# EAGLE design ESP32_zigbee_zwaveV1 (EAGLE 9.6.2)
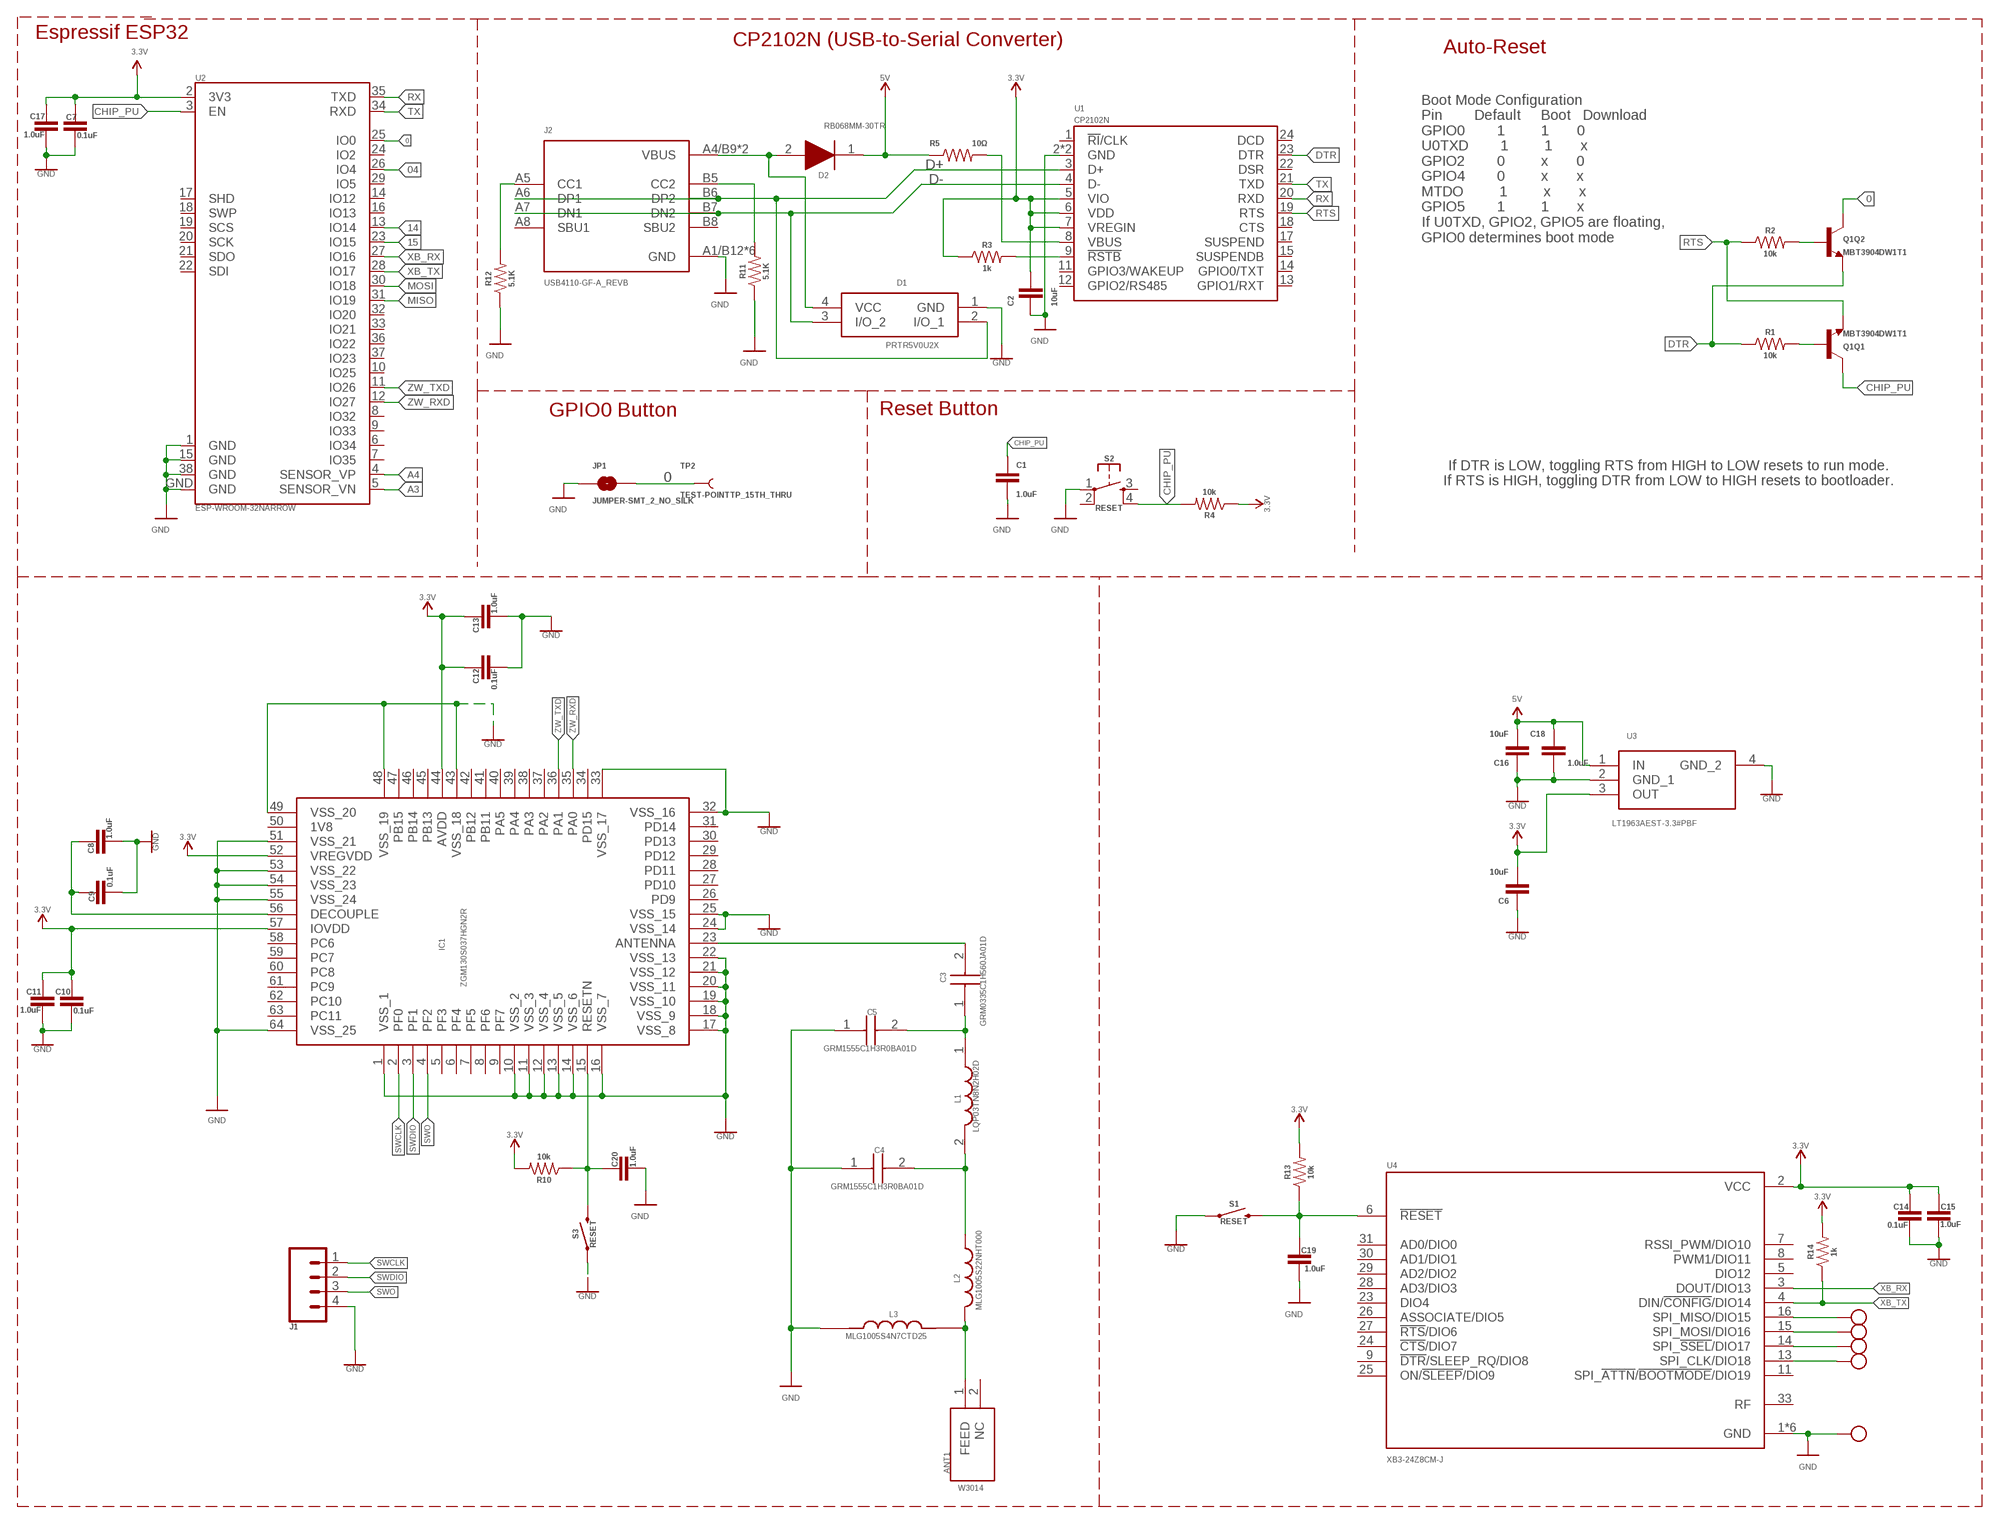
[diagram p0: schematic, sheet 1]

## Parts
ANT1  W3014  [ANTC10032X155N]
C1  1.0uF  1.0UF-0402T-16V-10%  [0402-TIGHT]
C2  10uF  10UF-0402T-6.3V-20%  [0402-TIGHT]
C3  GRM0335C1H560JA01D  [CAPC0603X33N]
C4  GRM1555C1H3R0BA01D  [CAPC1005X55N]
C5  GRM1555C1H3R0BA01D  [CAPC1005X55N]
C6  10uF  10UF-0805-25V-10%  [0805]
C7  0.1uF  0.1UF-0402T-6.3V-10%-X7R  [0402-TIGHT]
C8  1.0uF  1.0UF-0402T-16V-10%  [0402-TIGHT]
C9  0.1uF  0.1UF-0402T-6.3V-10%-X7R  [0402-TIGHT]
C10  0.1uF  0.1UF-0402T-6.3V-10%-X7R  [0402-TIGHT]
C11  1.0uF  1.0UF-0402T-16V-10%  [0402-TIGHT]
C12  0.1uF  0.1UF-0402T-6.3V-10%-X7R  [0402-TIGHT]
C13  1.0uF  1.0UF-0402T-16V-10%  [0402-TIGHT]
C14  0.1uF  0.1UF-0402T-6.3V-10%-X7R  [0402-TIGHT]
C15  1.0uF  1.0UF-0402T-16V-10%  [0402-TIGHT]
C16  10uF  10UF-0805-25V-10%  [0805]
C17  1.0uF  1.0UF-0402T-16V-10%  [0402-TIGHT]
C18  1.0uF  1.0UF-0402T-16V-10%  [0402-TIGHT]
C19  1.0uF  1.0UF-0402T-16V-10%  [0402-TIGHT]
C20  1.0uF  1.0UF-0402T-16V-10%  [0402-TIGHT]
D1  PRTR5V0U2X  [PRTR5V0U2X]
D2  RB068MM-30TR  [SODFL3516X90N]
IC1  ZGM130S037HGN2R  [ZGM130S037HGN2R]
J1  CONN_041X04_NO_SILK  [1X04_NO_SILK]
J2  USB4110-GF-A_REVB  [GCT_USB4110-GF-A_REVB]
JP1  JUMPER-SMT_2_NO_SILK  [SMT-JUMPER_2_NO_SILK]
L1  LQP03TN8N2H02D  [LQP03TG3N1B02D]
L2  MLG1005S22NHT000  [INDC1005X55N]
L3  MLG1005S4N7CTD25  [INDC1005X55N]
Q1  MBT3904DW1T1  TRANS_NPN_DUAL-MBT3904DW1T1  [SC70-6]
R1  10k  10KOHM-0402T-1/16W-1%  [0402-TIGHT]
R2  10k  10KOHM-0402T-1/16W-1%  [0402-TIGHT]
R3  1k  1KOHM-0402T-1/16W-1%  [0402-TIGHT]
R4  10k  10KOHM-0402T-1/16W-1%  [0402-TIGHT]
R5  10Ω  10OHM-0402-1/16W-5%  [0402-TIGHT]
R10  10k  10KOHM-0402-1/10W-0.1%  [0402-TIGHT]
R11  5.1K  RESISTOR0402T  [0402-TIGHT]
R12  5.1K  RESISTOR0402T  [0402-TIGHT]
R13  10k  10KOHM-0402-1/10W-0.1%  [0402-TIGHT]
R14  1k  1KOHM-0402T-1/16W-1%  [0402-TIGHT]
S1  RESET  MOMENTARY-SWITCH-SPST-SMD-4.6X2.8MM  [TACTILE_SWITCH_SMD_4.6X2.8MM]
S2  RESET  MOMENTARY-SWITCH-SPST-2-SMD-4.6X2.8MM  [TACTILE_SWITCH_SMD_4.6X2.8MM]
S3  RESET  MOMENTARY-SWITCH-SPST-SMD-4.6X2.8MM  [TACTILE_SWITCH_SMD_4.6X2.8MM]
TP1  TESTPOINT1.5X2.0MM_NOCREAM  [PAD-1.5X2.0]
TP2  TEST-POINTTP_15TH_THRU  [TP_15TH]
TP3  TESTPOINT1.5X2.0MM_NOCREAM  [PAD-1.5X2.0]
TP4  TESTPOINT1.5X2.0MM_NOCREAM  [PAD-1.5X2.0]
TP5  TESTPOINT1.5X2.0MM_NOCREAM  [PAD-1.5X2.0]
TP6  TESTPOINT1.5X2.0MM_NOCREAM  [PAD-1.5X2.0]
U1  CP2102N  [QFN24]
U2  ESP-WROOM-32NARROW  [ESP-WROOM-32-NARROW]
U3  LT1963AEST-3.3#PBF  [SOT230P700X180-4N]
U4  XB3-24Z8CM-J  [XCVR_XB3-24Z8CM-J]

## Nets
0: JP1.2 Q1.6(Q2:C) TP2.P$1 U2.25(IO0)
3.3V: C2.1 C6.2 C7.1 C10.1 C11.2 C12.1 C13.2 C14.1 C15.2 C17.2 IC1.44(AVDD) IC1.52(VREGVDD) IC1.57(IOVDD) R3.1 R4.1 R10.2 R13.2 R14.2 U1.5(VIO) U1.6(VDD) U1.7(VREGIN) U2.2(3V3) U3.3(OUT) U4.2(VCC)
04: U2.26(IO4)
5V: C16.2 C18.2 D2.1(K) R5.1 U3.1(IN)
14: U2.13(IO14)
15: U2.23(IO15)
A3: U2.5(SENSOR_VN)
A4: U2.4(SENSOR_VP)
CHIP_PU: C1.1 Q1.3(Q1:C) R4.2 S2.4 U2.3(EN)
D+: D1.2(I/O_1) J2.A6(DP1) J2.B6(DP2) U1.3(D+)
D-: D1.3(I/O_2) J2.A7(DN1) J2.B7(DN2) U1.4(D-)
DTR: Q1.1(Q2:E) R1.1 U1.23(DTR)
GND: C1.2 C2.2 C4.1 C5.1 C6.1 C7.2 C8.1 C9.2 C10.2 C11.1 C12.2 C13.1 C14.2 C15.1 C16.1 C17.1 C18.1 C19.2 C20.2 D1.1(GND) IC1.1(VSS_1) IC1.10(VSS_2) IC1.11(VSS_3) IC1.12(VSS_4) IC1.13(VSS_5) IC1.14(VSS_6) IC1.16(VSS_7) IC1.17(VSS_8) IC1.18(VSS_9) IC1.19(VSS_10) IC1.20(VSS_11) IC1.21(VSS_12) IC1.22(VSS_13) IC1.24(VSS_14) IC1.25(VSS_15) IC1.32(VSS_16) IC1.33(VSS_17) IC1.43(VSS_18) IC1.48(VSS_19) IC1.49(VSS_20) IC1.51(VSS_21) IC1.53(VSS_22) IC1.54(VSS_23) IC1.55(VSS_24) IC1.64(VSS_25) J1.4 J2.A1/B12(GND) J2.B1/A12(GND) J2.S1(GND) J2.S2(GND) J2.S3(GND) J2.S4(GND) JP1.1 L3.1 R11.1 R12.1 S1.1 S1.2 S2.1 S3.1 S3.2 TP6.P$1 U1.2(GND) U1.PAD(GND) U2.1(GND) U2.15(GND) U2.38(GND) U2.GND U3.2(GND_1) U3.4(GND_2) U4.1(GND) U4.10(GND) U4.12(GND) U4.21(GND) U4.32(GND) U4.34(GND)
MISO: U2.31(IO19)
MOSI: U2.30(IO18)
N$1: Q1.5(Q1:B) R1.2
N$2: Q1.2(Q2:B) R2.2
N$3: R3.2 U1.9(!RSTB)
N$4: R5.2 U1.8(VBUS)
N$5: C3.2 IC1.23(ANTENNA)
N$6: C3.1 C5.2 L1.1
N$7: C4.2 L1.2 L2.1
N$8: ANT1.1(FEED) L2.2 L3.2
N$9: D1.4(VCC) D2.2(A) J2.A4/B9(VBUS) J2.B4/A9(VBUS)
N$10: C20.1 IC1.15(RESETN) R10.1 S3.3 S3.4
N$11: J2.B5(CC2) R11.2
N$12: J2.A5(CC1) R12.2
N$13: C19.1 R13.1 S1.3 S1.4 U4.6(!RESET)
N$14: C8.2 C9.1 IC1.56(DECOUPLE)
N$15: TP5.P$1 U4.16(SPI_MISO/DIO15)
N$16: TP1.P$1 U4.15(SPI_MOSI/DIO16)
N$17: TP3.P$1 U4.14(SPI_!SSEL!/DIO17)
N$18: TP4.P$1 U4.13(SPI_CLK/DIO18)
RTS: Q1.4(Q1:E) R2.1 U1.19(RTS)
RX: U1.20(RXD) U2.35(TXD)
SWCLK: IC1.2(PF0) J1.1
SWDIO: IC1.3(PF1) J1.2
SWO: IC1.4(PF2) J1.3
TX: U1.21(TXD) U2.34(RXD)
XB_RX: U2.27(IO16) U4.3(DOUT/DIO13)
XB_TX: R14.1 U2.28(IO17) U4.4(DIN/!CONFIG!/DIO14)
ZW_RXD: IC1.35(PA0) U2.12(IO27)
ZW_TXD: IC1.36(PA1) U2.11(IO26)
Unconnected: ANT1.2(NC) IC1.5(PF3) IC1.6(PF4) IC1.7(PF5) IC1.8(PF6) IC1.9(PF7) IC1.26(PD9) IC1.27(PD10) IC1.28(PD11) IC1.29(PD12) IC1.30(PD13) IC1.31(PD14) IC1.34(PD15) IC1.37(PA2) IC1.38(PA3) IC1.39(PA4) IC1.40(PA5) IC1.41(PB11) IC1.42(PB12) IC1.45(PB13) IC1.46(PB14) IC1.47(PB15) IC1.50(1V8) IC1.58(PC6) IC1.59(PC7) IC1.60(PC8) IC1.61(PC9) IC1.62(PC10) IC1.63(PC11) J2.A8(SBU1) J2.B8(SBU2) S2.2 S2.3 U1.1(!RI!/CLK) U1.11(GPIO3/WAKEUP) U1.12(GPIO2/RS485) U1.13(GPIO1/RXT) U1.14(GPIO0/TXT) U1.15(SUSPENDB) U1.17(SUSPEND) U1.18(CTS) U1.22(DSR) U1.24(DCD) U2.6(IO34) U2.7(IO35) U2.8(IO32) U2.9(IO33) U2.10(IO25) U2.14(IO12) U2.16(IO13) U2.17(SHD) U2.18(SWP) U2.19(SCS) U2.20(SCK) U2.21(SDO) U2.22(SDI) U2.24(IO2) U2.29(IO5) U2.32(IO20) U2.33(IO21) U2.36(IO22) U2.37(IO23) U4.5(DIO12) U4.7(RSSI_PWM/DIO10) U4.8(PWM1/DIO11) U4.9(!DTR!/SLEEP_RQ/DIO8) U4.11(SPI_!ATTN!/!BOOTMODE!/DIO19) U4.23(DIO4) U4.24(!CTS!/DIO7) U4.25(ON/!SLEEP!/DIO9) U4.26(ASSOCIATE/DIO5) U4.27(!RTS!/DIO6) U4.28(AD3/DIO3) U4.29(AD2/DIO2) U4.30(AD1/DIO1) U4.31(AD0/DIO0) U4.33(RF)

## Notes on the sheet
- Espressif ESP32
- CP2102N (USB-to-Serial Converter)
- Auto-Reset
- Boot Mode Configuration
  Pin        Default     Boot   Download
  GPIO0        1         1       0
  U0TXD        1         1       x
  GPIO2        0         x       0
  GPIO4        0         x       x
  MTDO         1         x       x
  GPIO5        1         1       x
  If U0TXD, GPIO2, GPIO5 are floating, 
  GPIO0 determines boot mode
- GPIO0 Button | Reset Button
- If DTR is LOW, toggling RTS from HIGH to LOW resets to run mode.
  If RTS is HIGH, toggling DTR from LOW to HIGH resets to bootloader.

## Library data of the parts
ANT1 = W3014:W3014: Antennas ISM Ceramic Monopole Antenna Source: Datasheet <https://www.mouser.com/datasheet/2/336/W3014-268293.pdf>; ARROW_PART_NUMBER: W3014; ARROW_PRICE-STOCK: https://www.arrow.com/en/products/w3014/pulse-electronics-corporation; DESCRIPTION: Antennas ISM Ceramic Monopole Antenna; HEIGHT: 1.55mm; MANUFACTURER_NAME: Pulse; MANUFACTURER_PART_NUMBER: W3014; MOUSER_PART_NUMBER: 673-W3014; MOUSER_PRICE-STOCK: https://www.mouser.com/Search/Refine.aspx?Keyword=673-W3014
C1 C8 C11 C13 C15 C17-C20 = ESP32_zigbee_zwaveV1:1.0UF: 1µF ceramic capacitors A capacitor is a passive two-terminal electrical component used to store electrical energy temporarily in an electric field.; PROD_ID: CAP-09822
C2 = ESP32_zigbee_zwaveV1:10UF: 10.0µF ceramic capacitors A capacitor is a passive two-terminal electrical component used to store electrical energy temporarily in an electric field.; PROD_ID: CAP-09824
C3 = ESP32_zigbee_zwaveV1:GRM0335C1H560JA01D: Murata 0201 GRM 56pF Ceramic Multilayer Capacitor, 50 V, +125C, C0G Dielectric, +/-5% SMD Source: Datasheet <https://psearch.en.murata.com/capacitor/product/GRM0335C1H560JA01#.html>; ARROW_PART_NUMBER: GRM0335C1H560JA01D; ARROW_PRICE-STOCK: https://www.arrow.com/en/products/grm0335c1h560ja01d/murata-manufacturing; DESCRIPTION: Murata 0201 GRM 56pF Ceramic Multilayer Capacitor, 50 V, +125C, C0G Dielectric, +/-5% SMD; HEIGHT: 0.33mm; MANUFACTURER_NAME: Murata Electronics; MANUFACTURER_PART_NUMBER: GRM0335C1H560JA01D; MOUSER_PART_NUMBER: 81-GRM0335C1H560JA1D; MOUSER_PRICE-STOCK: https://www.mouser.com/Search/Refine.aspx?Keyword=81-GRM0335C1H560JA1D
C4 C5 = ESP32_zigbee_zwaveV1:GRM1555C1H3R0BA01D: Capacitor MLCC GRM 0402 3pF 50V C0G Murata 0402 GRM 3pF Ceramic Multilayer Capacitor, 50 V dc, +125C, C0G Dielectric, +/-0.1pF SMD Source: Datasheet <https://datasheet.datasheetarchive.com/originals/distributors/Datasheets_SAMA/ec4f1577dddcc7a13ddad897a28002d3.pdf>; ARROW_PART_NUMBER: GRM1555C1H3R0BA01D; ARROW_PRICE-STOCK: https://www.arrow.com/en/products/grm1555c1h3r0ba01d/murata-manufacturing?region=nac; DESCRIPTION: Capacitor MLCC GRM 0402 3pF 50V C0G Murata 0402 GRM 3pF Ceramic Multilayer Capacitor, 50 V dc, +125C, C0G Dielectric, +/-0.1pF SMD; HEIGHT: 0.55mm; MANUFACTURER_NAME: Murata Electronics; MANUFACTURER_PART_NUMBER: GRM1555C1H3R0BA01D; MOUSER_PART_NUMBER: 81-GRM1555C1H3R0BA1D; MOUSER_PRICE-STOCK: https://www.mouser.co.uk/ProductDetail/Murata-Electronics/GRM1555C1H3R0BA01D?qs=ouTquLLW2S5g5Yak4wnjeg%3D%3D
C6 C16 = SparkFun-Capacitors:10UF: 10.0µF ceramic capacitors A capacitor is a passive two-terminal electrical component used to store electrical energy temporarily in an electric field.; PROD_ID: CAP-14259
C7 C9 C10 C12 C14 = ESP32_zigbee_zwaveV1:0.1UF: 0.1µF ceramic capacitors A capacitor is a passive two-terminal electrical component used to store electrical energy temporarily in an electric field.; PROD_ID: CAP-14993
D1 = SamacSys_Parts:PRTR5V0U2X: NEXPERIA - PRTR5V0U2X - DIODE, TVS, DUAL, SOT-143B Source: Datasheet <https://assets.nexperia.com/documents/data-sheet/PRTR5V0U2X.pdf>; DESCRIPTION: NEXPERIA - PRTR5V0U2X - DIODE, TVS, DUAL, SOT-143B; HEIGHT: 1.1mm; MANUFACTURER_NAME: Nexperia; MANUFACTURER_PART_NUMBER: PRTR5V0U2X; MOUSER_PART_NUMBER: N/A; MOUSER_PRICE-STOCK: https://www.mouser.com/Search/Refine.aspx?Keyword=N%2FA
D2 = SamacSys_Parts:RB068MM-30TR: ROHM 30V 2A, SiC Schottky Diode, 2-Pin SOD-123FL RB068MM-30TR Source: Datasheet <https://www.rohm.com/products/mosfets/automotive/high-voltage/r8001cnd3fra-product>; DESCRIPTION: ROHM 30V 2A, SiC Schottky Diode, 2-Pin SOD-123FL RB068MM-30TR; HEIGHT: 0.9mm; MANUFACTURER_NAME: ROHM Semiconductor; MANUFACTURER_PART_NUMBER: RB068MM-30TR; MOUSER_PART_NUMBER: 755-RB068MM-30TR; MOUSER_PRICE-STOCK: https://www.mouser.co.uk/ProductDetail/ROHM-Semiconductor/RB068MM-30TR?qs=4v%252BiZTmLVHE5MqE1qrhPVA%3D%3D
IC1 = ESP32_zigbee_zwaveV1:ZGM130S037HGN2R: Z-Wave Module 64-Pin LGA T/R Source: Datasheet <https://www.silabs.com/documents/public/data-sheets/zgm130s-datasheet.pdf>; ARROW_PART_NUMBER: ZGM130S037HGN2R; ARROW_PRICE-STOCK: https://www.arrow.com/en/products/zgm130s037hgn2r/silicon-labs; DESCRIPTION: Z-Wave Module 64-Pin LGA T/R; HEIGHT: 1.3mm; MANUFACTURER_NAME: Silicon Labs; MANUFACTURER_PART_NUMBER: ZGM130S037HGN2R; MOUSER_PART_NUMBER: 634-ZGM130S037HGN2R; MOUSER_PRICE-STOCK: https://www.mouser.co.uk/ProductDetail/Silicon-Labs/ZGM130S037HGN2R?qs=OTrKUuiFdkYipTRfJ5tk3g%3D%3D
J1 = ESP32_zigbee_zwaveV1:CONN_04: Multi connection point. Often used as Generic Header-pin footprint for 0.1 inch spaced/style header connections On any of the 0.1 inch spaced packages, you can populate with these: Break Away Headers - Straight <https://www.sparkfun.com/products/116> (PRT-00116) Break Away Male Headers - Right Angle <https://www.sparkfun.com/products/553> (PRT-00553) Female Headers <https://www.sparkfun.com/products/115> (PRT-00115) Break Away Headers - Machine Pin <https://www.sparkfun.com/products/117> (PRT-00117) Break Away Female Headers - Swiss Machine Pin <https://www.sparkfun.com/products/743> (PRT-00743) For SCREWTERMINALS and SPRING TERMINALS visit here: Screw Terimnals on SparkFun.com <https://www.sparkfun.com/search/results?term=Screw+Terminals> (5mm/3.5mm/2.54mm spacing) This device is also useful as a general connection point to wire up your design to another part of your project. Our various solder wires solder well into these plated through hole pads. Hook-Up Wire - Assortment (Stranded, 22 AWG) <https://www.sparkfun.com/products/11375> (PRT-11375) Hook-Up Wire - Assortment (Solid Core, 22 AWG) <https://www.sparkfun.com/products/11367> (PRT-11367) View the entire wire category on our website here <https://www.sparkfun.com/categories/141> Special notes: Molex polarized connector foot print use with SKU : PRT-08231 with associated crimp pins and housings. 1MM SMD Version SKU: PRT-10208; PROD_ID: CONN-09696
J2 = ESP32_zigbee_zwaveV1:USB4110-GF-A_REVB: Check availability <https://pricing.snapeda.com/parts/USB4110-GF-A/GCT/view-part?ref=eda>; AVAILABILITY: In Stock; DESCRIPTION: USB-C (USB TYPE-C) USB 2.0 Receptacle Connector 24 (16+8 Dummy) Position Surface Mount, Right Angle; Through Hole; MF: GCT; MP: USB4110-GF-A; PACKAGE: None; PRICE: None; PURCHASE-URL: https://pricing.snapeda.com/search/part/USB4110-GF-A/?ref=eda
JP1 = ESP32_zigbee_zwaveV1:JUMPER-SMT_2_NO: Normally open jumper This jumper has two pads in close proximity to each other. Apply solder to close the connection. Round pads are easier to solder for beginners, but are a lot larger. SparkFun Product that uses the round pads: SparkFun EL Sequencer <https://www.sparkfun.com/products/12781>
L1 = ESP32_zigbee_zwaveV1:LQP03TN8N2H02D: Murata LQP Series Shielded Wire-wound SMD Inductor with a Non-Magnetic Core Core, 8.2 nH +/-3% 250mA Idc Q:14 Source: Datasheet <https://psearch.en.murata.com/inductor/product/LQP03TN8N2H02#.html>; ARROW_PART_NUMBER: LQP03TN8N2H02D; ARROW_PRICE-STOCK: https://www.arrow.com/en/products/lqp03tn8n2h02d/murata-manufacturing; DESCRIPTION: Murata LQP Series Shielded Wire-wound SMD Inductor with a Non-Magnetic Core Core, 8.2 nH +/-3% 250mA Idc Q:14; HEIGHT: 0.33mm; MANUFACTURER_NAME: Murata Electronics; MANUFACTURER_PART_NUMBER: LQP03TN8N2H02D; MOUSER_PART_NUMBER: 81-LQP03TN8N2H02D; MOUSER_PRICE-STOCK: https://www.mouser.co.uk/ProductDetail/Murata-Electronics/LQP03TN8N2H02D?qs=e%252BE4OD6MgMeYCCZ2V7FxZw%3D%3D
L2 = MLG1005S22NHT000:MLG1005S22NHT000: FIXED IND 22NH 350MA 700 MOHM Check availability <https://pricing.snapeda.com/parts/MLG1005S22NHT000/TDK/view-part?ref=eda>; AVAILABILITY: In Stock; DESCRIPTION: Inductor High Frequency Chip Unshielded Multi-Layer 0.022uH 3% 100MHz 8Q-Factor Ceramic 0.35A 0.7Ohm DCR 0402 T/R; MF: TDK; MP: MLG1005S22NHT000; PACKAGE: 1005 Taiyo Yuden; PRICE: None; PURCHASE-URL: https://pricing.snapeda.com/search/part/MLG1005S22NHT000/?ref=eda
L3 = MLG1005S4N7CTD25:MLG1005S4N7CTD25: FIXED IND 4.7NH 700MA 250 MOHM Check availability <https://pricing.snapeda.com/parts/MLG1005S4N7CTD25/TDK/view-part?ref=eda>; AVAILABILITY: In Stock; DESCRIPTION: Fixed Ind 4.7nh 700ma 250 Mohm; MF: TDK; MP: MLG1005S4N7CTD25; PACKAGE: 1005 Taiyo Yuden; PRICE: None; PURCHASE-URL: https://pricing.snapeda.com/search/part/MLG1005S4N7CTD25/?ref=eda
Q1 = ESP32_zigbee_zwaveV1:TRANS_NPN_DUAL: Dual NPN Transistors in Single Package The MBT3904W1 puts two general purpose 3904 NPN transistors in a single package. Datasheet <http://www.onsemi.com/pub_link/Collateral/MBT3904DW1T1-D.PDF> SparkFun Products: SparkFun ESP32 Thing <https://www.sparkfun.com/products/13907>; PROD_ID: TRANS-13337
R1 R2 R4 R10 R13 = ESP32_zigbee_zwaveV1:10KOHM: 10kΩ resistor A resistor is a passive two-terminal electrical component that implements electrical resistance as a circuit element. Resistors act to reduce current flow, and, at the same time, act to lower voltage levels within circuits. - Wikipedia; PROD_ID: RES-14241
R3 R14 = ESP32_zigbee_zwaveV1:1KOHM: 1kΩ resistor A resistor is a passive two-terminal electrical component that implements electrical resistance as a circuit element. Resistors act to reduce current flow, and, at the same time, act to lower voltage levels within circuits. - Wikipedia; PROD_ID: RES-14342
R5 = ESP32_zigbee_zwaveV1:10OHM: 10Ω resistor A resistor is a passive two-terminal electrical component that implements electrical resistance as a circuit element. Resistors act to reduce current flow, and, at the same time, act to lower voltage levels within circuits. - Wikipedia; PROD_ID: RES-16072
R11 R12 = ESP32_zigbee_zwaveV1:RESISTOR: Generic Resistor Package
S1 S3 = ESP32_zigbee_zwaveV1:MOMENTARY-SWITCH-SPST: Momentary Switch (Pushbutton) - SPST Normally-open (NO) SPST momentary switches (buttons, pushbuttons). Variants PTH-12MM - 12mm square, through-hole Momentary Pushbutton Switch - 12mm Square <https://www.sparkfun.com/products/9190> (COM-09190) PTH-6.0MM, PTH-6.0MM-KIT - 6.0mm square, through-hole Mini Pushbutton Switch <https://www.sparkfun.com/products/97> (COM-00097) KIT package intended for soldering kit's - only one side of pads' copper is exposed. PTH-RIGHT-ANGLE-KIT - Right-angle, through-hole Right Angle Tactile Button <https://www.sparkfun.com/products/10791> - Used on SparkFun BigTime Watch Kit <https://www.sparkfun.com/products/11734> SMD-12MM - 12mm square, surface-mount Tactile Button - SMD (12mm) <https://www.sparkfun.com/products/12993> (COM-12993) Used on SparkFun PicoBoard <https://www.sparkfun.com/products/11888> SMD-4.5MM - 4.5mm Square Trackball Switch Used on SparkFun Blackberry Trackballer Breakout <https://www.sparkfun.com/products/13169> SMD-4.6MMX2.8MM - 4.60mm x 2.80mm, surface mount Used on SparkFun Pro Micro - RP2040 <https://www.sparkfun.com/products/17717> SMD-5.2MM, SMD-5.2-REDUNDANT - 5.2mm square, surface-mount Mini Pushbutton Switch - SMD <https://www.sparkfun.com/products/8720> (COM-08720) Used on Arduino Pro Mini <https://www.sparkfun.com/products/11114> REDUNDANT package connects both switch circuits together SMD-6.0X3.5MM - 6.0 x 3.5mm, surface mount Momentary Reset Switch SMD <https://www.sparkfun.com/products/8229> (COM-08229) SMD-6.2MM-TALL - 6.2mm square, surface mount Tactile Button - SMD (6mm) <https://www.sparkfun.com/products/12992> Used on SparkFun Digital Sandbox <https://www.sparkfun.com/products/12651> SMD-RIGHT-ANGLE - Right-angle, surface mount Used on SparkFun Block for Intel® Edison - Arduino <https://www.sparkfun.com/products/13036>; PROD_ID: COMP-12265; SF_SKU: COM-12993
S2 = ESP32_zigbee_zwaveV1:MOMENTARY-SWITCH-SPST-2: Momentary Switch (Pushbutton) - SPST - Two Circuits Normally-open (NO) SPST momentary switches (buttons, pushbuttons). Schematic symbol includes two switch circuits. Variants SMD-4.6MMX2.8MM - 4.60mm x 2.80mm Tactile Momentary Button Switch - Used on SparkFun SAMD21 Mini Breakout <https://www.sparkfun.com/products/13664> SMD-5.2MM - Mini Pushbutton Switch - SMD <https://www.sparkfun.com/products/8720> - Used on Arduino Pro Mini <https://www.sparkfun.com/products/11114>; PROD_ID: SWCH-08247; SF_SKU: COM-08720
TP1 TP3-TP6 = microbuilder:TESTPOINT: Test Point Various test points for characterisation and PCB testing TESTPOINT_SMT - Compact Surface Mount Test Point [Digikey: 5016KTR-ND]
TP2 = ESP32_zigbee_zwaveV1:TEST-POINT: SparkFun Test Points Bare copper test points for troubleshooting or In-Circuit-Testing. These are used by our Production team for verifying production board runs using pogo-pins on test beds. SparkFun Products: SparkFun LSM9DS1 Breakout <https://www.sparkfun.com/products/13284> SparkFun PSOC <https://www.sparkfun.com/products/13714> SparkFun Load Cell Amplifier <https://www.sparkfun.com/products/13879>
U1 = ESP32_zigbee_zwaveV1:CP2102N; PROD_ID: IC-14020
U2 = ESP32_zigbee_zwaveV1:ESP-WROOM-32; PROD_ID: IC-13849
U3 = LT1963AEST-3.3#PBF:LT1963AEST-3.3#PBF: LDO Regulator 3.3V 1.5A Low Noise SOT223 Linear Technology LT1963AEST-3.3#PBF, LDO Voltage Regulator, 1.5A, 3.3 V, -20 20 Vin, 4-Pin SOT-223 Source: Datasheet <http://www.farnell.com/datasheets/1761433.pdf>; ARROW_PART_NUMBER: LT1963AEST-3.3#PBF; ARROW_PRICE-STOCK: https://www.arrow.com/en/products/lt1963aest-3.3pbf/linear-technology; DESCRIPTION: LDO Regulator 3.3V 1.5A Low Noise SOT223 Linear Technology LT1963AEST-3.3#PBF, LDO Voltage Regulator, 1.5A, 3.3 V, -20 20 Vin, 4-Pin SOT-223; HEIGHT: 1.8mm; MANUFACTURER_NAME: Analog Devices; MANUFACTURER_PART_NUMBER: LT1963AEST-3.3#PBF; MOUSER_PART_NUMBER: 584-1963AEST-3.3PBF; MOUSER_PRICE-STOCK: https://www.mouser.co.uk/ProductDetail/Analog-Devices/LT1963AEST-3.3PBF?qs=ytflclh7QUWACCdXyVJ5gA%3D%3D
U4 = ESP32_zigbee_zwaveV1:XB3-24Z8CM-J: XBee3, 2.4 GHz ZB 3.0, Chip Ant, MMT Check availability <https://pricing.snapeda.com/parts/XB3-24Z8CM-J/Digi%20International/view-part?ref=eda>; AVAILABILITY: In Stock; DESCRIPTION: 802.15.4 Zigbee® Transceiver Module 2.4GHz Integrated, Chip Surface Mount; MF: Digi International; MP: XB3-24Z8CM-J; PACKAGE: SMD-34 Digi International; PRICE: None; PURCHASE-URL: https://pricing.snapeda.com/search/part/XB3-24Z8CM-J/?ref=eda

## Board
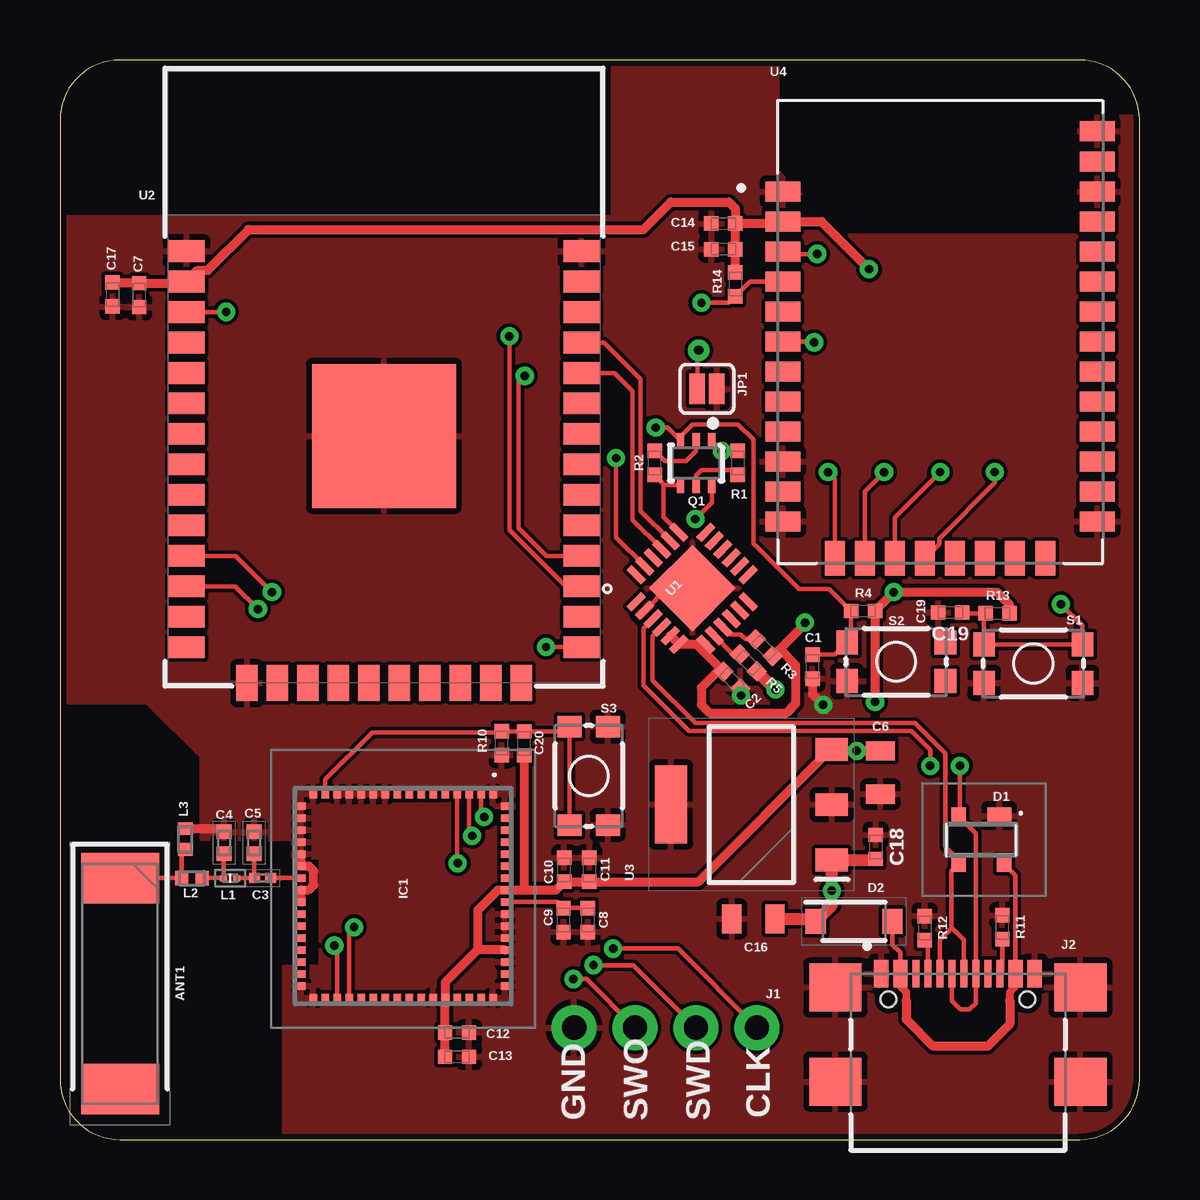
[diagram p1: board, top side]
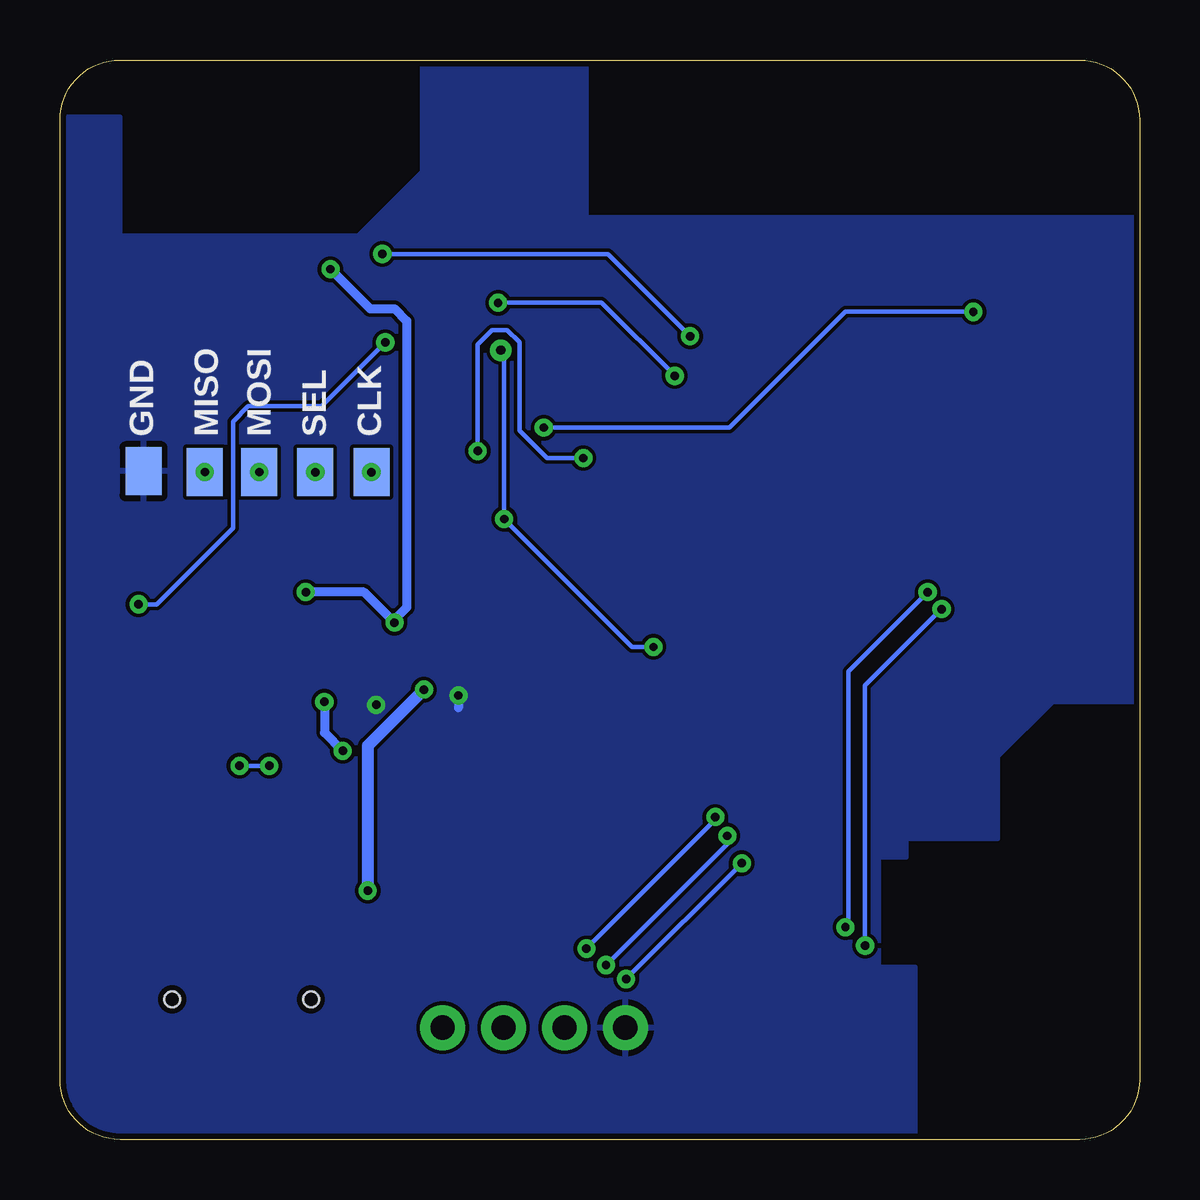
[diagram p2: board, bottom side, seen from below]

Size 45 x 45 mm. Coordinates in mm from the lower left corner, seen from the top.
Outline: 0,42.5 0,2.5 arc90 2.5,0 42.5,0 arc90 45,2.5 45,42.5 arc90 42.5,45 2.5,45 arc90 0,42.5
Copper layers (1*16): Top 0.035mm / dielectric 1.5mm / Bottom 0.035mm
Design rules "default *": minimum track width 6mil, minimum drill 0.35mm, track to track 6mil, track to pad 6mil, pad to pad 6mil, via to via 6mil, smd to smd 6mil, copper to edge 10mil, drill to drill 6mil, minimum pad ring 10mil, minimum via ring 8mil, stop-mask expansion 4mil, vias tented up to drill 25mil, thermal gap 10mil

### Footprints (pad centres in the part's own frame; a part is rotated, then mirrored left to right if it is on the bottom)
ANTC10032X155N = smd 2.1 x 3.25: 1 -4.4,0; 2 4.4,0
0402-TIGHT = smd 0.6 x 0.6: 1 -0.5,0; 2 0.5,0
CAPC0603X33N = smd 0.46 x 0.42: 1 -0.33,0; 2 0.33,0
CAPC1005X55N = smd 0.6 x 0.62: 1 -0.46,0; 2 0.46,0
0805 = smd 0.8 x 1.2: 1 -0.9,0; 2 0.9,0
PRTR5V0U2X = smd 1 x 0.7: 1 -0.75,-1 | smd 0.6 x 0.7: 2 0.95,-1; 3 0.95,1; 4 -0.95,1
SODFL3516X90N = smd 0.84 x 1.04: 1 -1.6,0; 2 1.6,0
ZGM130S037HGN2R = smd 0.35 x 0.3: 1 -4.25,3.75; 2 -4.25,3.25; 3 -4.25,2.75; 4 -4.25,2.25; 5 -4.25,1.75; 6 -4.25,1.25; 7 -4.25,0.75; 8 -4.25,0.25; 9 -4.25,-0.25; 10 -4.25,-0.75; 11 -4.25,-1.25; 12 -4.25,-1.75; 13 -4.25,-2.25; 14 -4.25,-2.75; 15 -4.25,-3.25; 16 -4.25,-3.75; 33 4.25,-3.75; 34 4.25,-3.25; 35 4.25,-2.75; 36 4.25,-2.25; 37 4.25,-1.75; 38 4.25,-1.25; 39 4.25,-0.75; 40 4.25,-0.25; 41 4.25,0.25; 42 4.25,0.75; 43 4.25,1.25; 44 4.25,1.75; 45 4.25,2.25; 46 4.25,2.75; 47 4.25,3.25; 48 4.25,3.75 | smd 0.3 x 0.35: 17 -3.75,-4.25; 18 -3.25,-4.25; 19 -2.75,-4.25; 20 -2.25,-4.25; 21 -1.75,-4.25; 22 -1.25,-4.25; 23 -0.75,-4.25; 24 -0.25,-4.25; 25 0.25,-4.25; 26 0.75,-4.25; 27 1.25,-4.25; 28 1.75,-4.25; 29 2.25,-4.25; 30 2.75,-4.25; 31 3.25,-4.25; 32 3.75,-4.25; 49 3.75,4.25; 50 3.25,4.25; 51 2.75,4.25; 52 2.25,4.25; 53 1.75,4.25; 54 1.25,4.25; 55 0.75,4.25; 56 0.25,4.25; 57 -0.25,4.25; 58 -0.75,4.25; 59 -1.25,4.25; 60 -1.75,4.25; 61 -2.25,4.25; 62 -2.75,4.25; 63 -3.25,4.25; 64 -3.75,4.25
1X04_NO_SILK = drill 1.016 pad 1.88: 1 0,0; 2 2.54,0; 3 5.08,0; 4 7.62,0
GCT_USB4110-GF-A_REVB = smd 0.6 x 1.15: A1/B12 -3.2,1.075; A4/B9 -2.4,1.075; B1/A12 3.2,1.075; B4/A9 2.4,1.075 | smd 0.3 x 1.15: A5 -1.25,1.075; A6 -0.25,1.075; A7 0.25,1.075; A8 1.25,1.075; B5 1.75,1.075; B6 0.75,1.075; B7 -0.75,1.075; B8 -1.75,1.075 | smd 2.18 x 2: S1 -5.11,0.5; S2 5.11,0.5; S3 -5.11,-3.43; S4 5.11,-3.43 | hole 0.65: -2.89,0; 2.89,0
SMT-JUMPER_2_NO_SILK = smd 0.635 x 1.27: 1 -0.406,0; 2 0.406,0
LQP03TG3N1B02D = smd 0.3 x 0.25: 1 -0.275,0; 2 0.275,0
INDC1005X55N = smd 0.54 x 0.6: 1 -0.432,0; 2 0.432,0
SC70-6 = smd 0.3 x 0.66: 1 -0.65,-0.92; 2 0,-0.92; 3 0.65,-0.92; 4 0.65,0.92; 5 0,0.92; 6 -0.65,0.92
TACTILE_SWITCH_SMD_4.6X2.8MM = smd 0.9 x 1: 1 -2.05,-0.8; 2 2.05,-0.8; 3 2.05,0.8; 4 -2.05,0.8
PAD-1.5X2.0 = smd 1.5 x 2: P$1 0,0
TP_15TH = drill 0.381 pad 0.61: P$1 0,0
QFN24 = smd 0.85 x 0.3: 1 -2.05,1.25; 2 -2.05,0.75; 3 -2.05,0.25; 4 -2.05,-0.25; 5 -2.05,-0.75; 6 -2.05,-1.25; 13 2.05,-1.25; 14 2.05,-0.75; 15 2.05,-0.25; 16 2.05,0.25; 17 2.05,0.75; 18 2.05,1.25 | smd 0.3 x 0.85: 7 -1.25,-2.05; 8 -0.75,-2.05; 9 -0.25,-2.05; 10 0.25,-2.05; 11 0.75,-2.05; 12 1.25,-2.05; 19 1.25,2.05; 20 0.75,2.05; 21 0.25,2.05; 22 -0.25,2.05; 23 -0.75,2.05; 24 -1.25,2.05 | smd 2.55 x 2.55: PAD 0,0
ESP-WROOM-32-NARROW = smd 0.9 x 1.5: 1 6.43,8.238; 2 5.16,8.238; 3 3.89,8.238; 4 2.62,8.238; 5 1.35,8.238; 6 0.08,8.238; 7 -1.19,8.238; 8 -2.46,8.238; 9 -3.73,8.238; 10 -5,8.238; 11 -6.27,8.238; 12 -7.54,8.238; 13 -8.81,8.238; 14 -10.08,8.238; 25 -10.08,-8.238; 26 -8.81,-8.238; 27 -7.54,-8.238; 28 -6.27,-8.238; 29 -5,-8.238; 30 -3.73,-8.238; 31 -2.46,-8.238; 32 -1.19,-8.238; 33 0.08,-8.238; 34 1.35,-8.238; 35 2.62,-8.238; 36 3.89,-8.238; 37 5.16,-8.238; 38 6.43,-8.238 | smd 1.5 x 0.9: 15 -11.57,5.715; 16 -11.57,4.445; 17 -11.57,3.175; 18 -11.57,1.905; 19 -11.57,0.635; 20 -11.57,-0.635; 21 -11.57,-1.905; 22 -11.57,-3.175; 23 -11.57,-4.445; 24 -11.57,-5.715 | smd 6 x 6: GND -1.27,0
SOT230P700X180-4N = smd 1.35 x 0.95: 1 -3.35,2.3; 2 -3.35,0; 3 -3.35,-2.3 | smd 1.35 x 3.25: 4 3.35,0
XCVR_XB3-24Z8CM-J = smd 1.448 x 0.838: 1 -6.553,5.842; 2 -6.553,4.592; 3 -6.553,3.343; 4 -6.553,2.093; 5 -6.553,0.843; 6 -6.553,-0.406; 7 -6.553,-1.656; 8 -6.553,-2.906; 9 -6.553,-4.155; 10 -6.553,-5.405; 11 -6.553,-6.655; 12 -6.553,-7.904; 21 6.553,-7.904; 22 6.553,-6.655; 23 6.553,-5.405; 24 6.553,-4.155; 25 6.553,-2.906; 26 6.553,-1.656; 27 6.553,-0.406; 28 6.553,0.843; 29 6.553,2.093; 30 6.553,3.343; 31 6.553,4.592; 32 6.553,5.842; 33 6.553,7.092; 34 6.553,8.357 | smd 0.838 x 1.448: 13 -4.381,-9.436; 14 -3.132,-9.436; 15 -1.882,-9.436; 16 -0.632,-9.436; 17 0.617,-9.436; 18 1.867,-9.436; 19 3.117,-9.436; 20 4.381,-9.436

### Placement (x,y rotation side)
ANT1  2.5,6.5 270 top
C1  31.37,19.71 270 top
C2  28.01,19.15 315 top
C3  8.44,10.9 0 top
C4  6.84,12.37 270 top
C5  8.1,12.37 270 top
C6  34.2,15.3 90 top
C7  3.3,35.2 270 top
C8  22,9.15 90 top
C9  20.99,9.15 270 top
C10  21.02,11.25 90 top
C11  22.07,11.25 270 top
C12  16.55,4.46 0 top
C13  16.55,3.45 180 top
C14  27.65,38.18 180 top
C15  27.65,37.11 0 top
C16  28.9,9.2 0 top
C17  2.19,35.22 90 top
C18  34,12.2 270 top
C19  37.11,21.97 180 top
C20  18.42,16.53 270 top
D1  38.4,12.5 180 top
D2  33.1,9.1 0 top
IC1  14.31,10.15 270 top
J1  29.05,4.66 180 top
J2  37.43,5.84 0 top
JP1  26.97,31.29 180 top
L1  7.09,10.9 180 top
L2  5.5,10.9 180 top
L3  5.23,12.53 270 top
Q1  26.52,28.2 180 top
R1  28.25,28.2 270 top
R2  24.79,28.2 90 top
R3  29.35,20.5 135 top
R4  33.47,22.03 180 top
R5  28.69,19.87 135 top
R10  19.35,16.51 270 top
R11  39.28,8.85 270 top
R12  36.04,8.82 270 top
R13  39.08,21.93 0 top
R14  28.15,35.65 90 top
S1  40.57,19.84 0 top
S2  34.86,19.91 0 top
S3  22.04,15.16 90 top
TP1  36.69,27.82 0 bottom
TP2  26.63,32.9 180 top
TP3  34.36,27.82 0 bottom
TP4  32.02,27.82 0 bottom
TP5  38.97,27.82 0 bottom
TP6  41.52,27.86 0 bottom
U1  26.36,22.98 45 top
U2  13.51,30.6 90 top
U3  28.82,13.96 180 top
U4  36.69,33.67 0 top

### Tracks (layer width: path | path; a pad name or v marks a point on that pad's centre or on a via)
0  (via drill 0.35)
  Top 0.178: Q1.6 27.17,26.55 v26.48,25.87 | v20.26,20.53 21.74,20.53 U2.25 | TP2.P$1 26.56,32.83 JP1.2
  Bottom 0.178: v20.26,20.53 21.15,20.53 v26.48,25.87 26.48,32.76 TP2.P$1
3.3V  (via drill 0.35)
  Top 0.178: C15.2 C14.1
  Top 0.381: C17.2 3.28,35.72 C7.1 5.21,35.7 U2.2 5.75,36.24 6.16,36.24 7.86,37.93 24.33,37.93 25.47,39.07 27.88,39.07 28.15,38.81 C14.1 | C14.1 30.05,38.18 U4.2 31.74,38.26 v33.72,36.28 | C6.2 v33.22,16.2 32.23,16.2 U3.3 32.12,16.26 26.61,10.75 C11.2 C10.1 20.67,10.4 19.24,10.4 | U1.5 U1.6 26.51,20.65 | 26.51,20.65 U1.7 | 26.51,20.65 C2.1 27.4,19.5 26.74,18.84 26.74,18.12 27.07,17.79 30.29,17.79 30.67,18.17 30.67,19.77 30,20.44 | C13.2 C12.1 16.05,5.58 IC1.44 16.06,6.55 17.41,7.9 | IC1.52 17.41,7.9 | 19.24,10.4 IC1.57 18.24,10.39 17.41,9.56 17.41,7.9 | R10.2 19.35,10.51 19.24,10.4 | R13.2 39.58,22.3 39.06,22.82 v34.76,22.82 R4.1 v33.97,18.25 v33.98,18.25 | R3.1 30,20.44 | 30,20.44 31.06,21.5 v31.06,21.55 | R14.2 C14.1
  Bottom 0.381: v31.06,21.55 31.12,21.61 | 31.12,21.61 32.33,22.82 v34.76,22.82 | v33.72,36.28 32.07,34.63 31.06,34.63 30.55,34.12 30.55,22.18 31.12,21.61 | v33.98,18.25 33.98,16.96 v33.22,16.2
5V  (via drill 0.35)
  Top 0.508: C16.2 31.4,9.2 D2.1 32.17,9.77 v32.17,10.37 U3.1 33.96,11.66 C18.2 | R5.1 29.81,18.75 v29.83,18.75
  Bottom 0.508: v29.83,18.75 32.17,16.41 v32.17,10.37
CHIP_PU  (via drill 0.35)
  Top 0.178: C1.1 32.3,20.21 S2.4 32.97,20.88 R4.2 32.06,22.94 30.8,22.94 28.9,24.85 28.9,29.17 28.26,29.8 26.36,29.8 25.77,29.22 | U2.3 6.91,34.49 v6.93,34.5 | v24.83,29.68 25.32,29.68 25.77,29.22 | 25.77,29.22 Q1.3
  Bottom 0.178: v6.93,34.5 12.26,34.5 17.09,29.68 v24.83,29.68
D+  (via drill 0.35)
  Top 0.178: J2.A6 37.18,5.77 37.53,5.42 37.91,5.42 38.18,5.69 J2.B6 38.18,12.77 D1.2 37.52,13.57 v37.52,15.58 | U1.3 24.33,21.3 24.33,18.92 26.22,17.03 35.49,17.03 36.28,16.24 v36.28,15.58
  Bottom 0.178: v36.28,15.58 v37.52,15.58
D-
  Top 0.178: J2.B7 36.68,8.34 37.17,8.83 37.68,8.32 J2.A7 | U1.4 24.71,20.97 24.71,19.14 26.48,17.36 35.63,17.36 36.9,16.09 36.9,12.19 37.45,11.64 D1.3 37.15,11.2 37.15,8.81
DTR  (via drill 0.35)
  Top 0.178: R1.1 v27.59,28.7 Q1.1 | U1.23 23.18,25.1 v23.18,28.41
  Bottom 0.178: v23.18,28.41 24.71,28.41 25.85,29.55 25.85,33.23 26.36,33.74 26.99,33.74 27.59,33.14 v27.59,28.7
GND  (via drill 0.35)
  Top 0.178: U1.2 25.3,22.98 U1.PAD
  Top 0.381: C2.2 28.39,18.77 v28.39,18.51 | IC1.25 IC1.24 10.38,10.41 10.58,10.61 10.58,11.19 10.38,11.39 10.18,11.39 10.06,11.52 | C1.2 31.37,18.57 v31.82,18.12 | IC1.22 10.06,11.52 | 10.06,11.52 IC1.21 | L3.1 6.71,12.96 C4.1
  Bottom 0.381: v28.39,18.51 28.39,17.99
  pour Top: -0.57,18.25 3.62,18.25 5.91,15.96 5.91,12.53 9.72,12.53 9.72,11.77 10.86,11.77 10.86,7.2 9.34,7.2 9.34,-0.04 45.15,-0.04 45.15,42.63 42.49,42.63 42.49,37.68 32.58,37.68 29.91,40.34 29.91,44.92 23.05,44.92 23.05,38.44 -0.57,38.44
  pour Bottom: -0.57,18.25 3.62,18.25 5.91,15.96 5.91,12.53 9.72,12.53 9.72,11.77 10.86,11.77 10.86,7.2 9.34,7.2 9.34,-0.04 45.15,-0.04 45.15,42.63 42.49,42.63 42.49,37.68 32.58,37.68 29.91,40.34 29.91,44.92 23.05,44.92 23.05,38.44 -0.57,38.44
N$1
  Top 0.178: 26.48,27.25 Q1.5 26.52,27.68 26.74,27.9 28.06,27.9 R1.2
N$2
  Top 0.178: R2.2 25.21,28.28 26.1,28.28 26.52,28.7 Q1.2
N$3
  Top 0.178: R3.2 28.57,20.86 28.37,21.06 27.95,21.06 27.66,21.35 U1.9
N$4
  Top 0.178: R5.2 28.06,20.22 U1.8
N$5
  Top 0.178: C3.2 IC1.23
N$6
  Top 0.178: C5.2 8.1,10.91 C3.1 L1.1
N$7
  Top 0.178: L2.1 L1.2 6.82,11.89 C4.2
N$8
  Top 0.178: ANT1.1 L2.2 5.07,11.94 L3.2
N$9
  Top 0.178: D2.2 34.7,8.12 35.03,7.8 J2.A4/B9 | 39.83,6.32 J2.B4/A9 39.83,11.02 D1.4
  Top 0.305: J2.A4/B9 35.03,6.38 35.27,6.14 35.27,5.8 | J2.B4/A9 39.83,6.38 39.59,6.14 39.59,5.8
  Top 0.381: 35.27,5.8 35.27,5.01 36.39,3.9 38.68,3.9 39.59,4.81 39.59,5.8
N$10
  Top 0.178: S3.3 21.14,17.11 | 21.14,17.11 21.04,17.01 R10.1 18.43,17.01 C20.1 18.36,16.98 13.02,16.98 11.06,15.01 IC1.15 | S3.4 21.24,17.01 21.14,17.11
N$11
  Top 0.178: R11.2 39.28,7.02 J2.B5
N$12
  Top 0.178: R12.2 36.17,8.19 J2.A5
N$13  (via drill 0.35)
  Top 0.178: C19.1 37.65,21.93 R13.1 38.52,21.87 S1.4 S1.3 | S1.3 | U4.6 31.41,33.26 v31.44,33.23 | v41.72,22.31 42.61,21.42 S1.3
  Bottom 0.178: v31.44,33.23 34.1,30.56 37.15,30.56 37.79,29.93 37.79,25.48 40.96,22.31 v41.72,22.31
N$14
  Top 0.178: C8.2 C9.1 20.74,9.9 IC1.56
N$15  (via drill 0.35)
  Top 0.178: U4.16 36.65,24.82 36.65,25.06 38.97,27.38 TP5.P$1
  other vias: 38.97,27.82
N$16  (via drill 0.35)
  Top 0.178: U4.15 34.81,25.94 TP1.P$1
  other vias: 36.69,27.82
N$17  (via drill 0.35)
  Top 0.178: U4.14 33.56,27.02 TP3.P$1
  other vias: 34.36,27.82
N$18  (via drill 0.35)
  Top 0.178: U4.13 32.31,27.53 TP4.P$1
  other vias: 32.02,27.82
RTS
  Top 0.178: R2.1 25.16,27.33 | 25.16,27.33 25.21,27.28 Q1.4 | U1.19 25.16,25.95 25.16,27.33
RX
  Top 0.178: U2.35 22.69,33.22 24.2,31.71 24.2,26.2 U1.20
SWCLK  (via drill 0.35)
  Top 0.178: J1.1 25.75,7.96 v23.05,7.96 | v17.68,13.44 17.56,13.56 IC1.2
  Bottom 0.178: v23.05,7.96 17.68,13.33 v17.68,13.44
SWDIO  (via drill 0.35)
  Top 0.178: J1.2 23.9,7.27 v22.24,7.27 | v17.18,12.66 17.06,12.78 IC1.3
  Bottom 0.178: v22.24,7.27 17.18,12.33 v17.18,12.66
SWO  (via drill 0.35)
  Top 0.178: J1.3 21.94,6.69 v21.4,6.69 | v16.58,11.52 16.56,11.53 IC1.4
  Bottom 0.178: v21.4,6.69 v16.58,11.52
TX
  Top 0.178: U1.21 23.87,25.83 23.87,31.2 23.12,31.95 U2.34
XB_RX  (via drill 0.35)
  Top 0.178: U2.27 21.68,23.13 21.01,23.13 18.74,25.4 v18.74,33.49 | v31.56,36.92 30.23,36.92 U4.3
  Bottom 0.178: v18.74,33.49 22.17,36.92 v31.56,36.92
XB_TX  (via drill 0.35)
  Top 0.178: U4.4 28.76,35.76 28.2,35.2 R14.1 27.88,34.88 v26.74,34.88 | U2.28 20.27,24.33 19.12,25.48 19.12,31.58 v19.37,31.83
  Bottom 0.178: v19.37,31.83 22.42,34.88 v26.74,34.88
ZW_RXD  (via drill 0.35)
  Top 0.178: U2.12 7.3,23.06 v8.25,22.11 | v11.44,8.09 11.56,7.97 IC1.35
  Bottom 0.178: v8.25,22.11 11.44,18.92 v11.44,8.09
ZW_TXD  (via drill 0.35)
  Top 0.178: U2.11 7.32,24.33 v8.83,22.82 | v12.26,8.85 12.13,8.72 12.06,8.72 IC1.36
  Bottom 0.178: v8.83,22.82 12.13,19.52 12.13,8.98 v12.26,8.85

### Text on the board
tPlace: GND
bPlace: CLK | SEL | MOSI | MISO
tNames: SWO | SWD | CLK
bNames: GND